# EAGLE schematic MHR15-GLV_PWR (EAGLE 6.6.0)
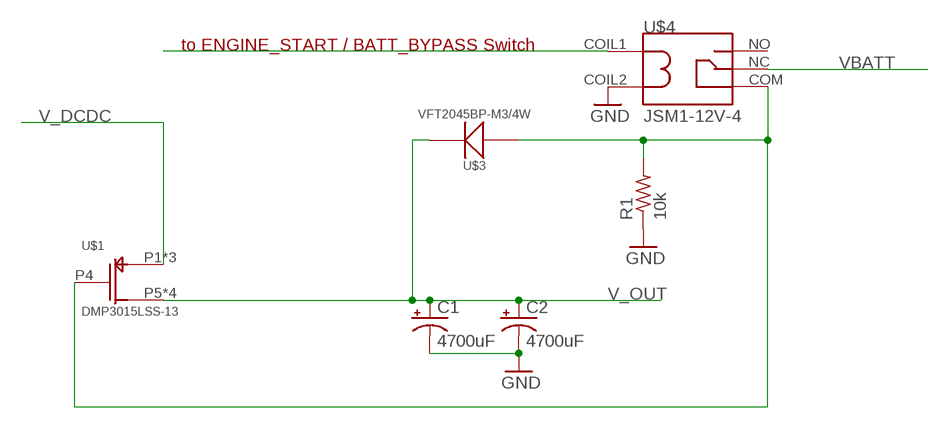
[diagram p0: schematic, sheet 1]

## Parts
C1  4700uF  CAP_POLPTH3  [CPOL-RADIAL-1000UF-63V]
C2  4700uF  CAP_POLPTH3  [CPOL-RADIAL-1000UF-63V]
R1  10k  R-US_R0603  [R0603]
U$1  DMP3015LSS-13  [8-SOP]
U$3  VFT2045BP-M3/4W  [VFT2045BP-M3/4W]
U$4  JSM1-12V-4  [JSM1-12V-4]

## Nets
GND: C1.2(-) C2.2(-) R1.1 U$4.COIL2
N$3: R1.2 U$1.P4(G) U$3.P1 U$4.COM
N$6: U$4.COIL1
V_DCDC: U$1.P1(S) U$1.P2(S) U$1.P3(S)
V_OUT: C1.1(+) C2.1(+) U$1.P5(D) U$1.P6(D) U$1.P7(D) U$1.P8(D) U$3.P2
VBATT: U$4.NC
Unconnected: U$4.NO

## Notes on the sheet
- to ENGINE_START / BATT_BYPASS Switch

## Library data of the parts
C1 C2 = SparkFun-Capacitors:CAP_POL: Capacitor Polarized These are standard SMD and PTH capacitors. Normally 10uF, 47uF, and 100uF in electrolytic and tantalum varieties. Always verify the external diameter of the through hole cap, it varies with capacity, voltage, and manufacturer. The EIA devices should be standard.
R1 = resistor:R-US_: RESISTOR, American symbol
U$1 = MHR15-GLV_PWR:DMP3015LSS-13: MOSFET P-CH 30V 13A 8-SOIC; DIGIKEY_PN: DMP3015LSSDICT-ND; MANUFACTURER: Diodes Incorporated; MFC_PN: DMP3015LSS-13
U$3 = MHR15-GLV_PWR:VFT2045BP-M3/4W: DIODE SCHOTTKY 45V 20A ITO220AC; DIGIKEY_PN: VFT2045BP-M3/4W-ND; MANUFACTURER: Vishay Semiconductor Diodes Division; MFC_PN: VFT2045BP-M3/4W
U$4 = MHR15-GLV_PWR:JSM1-12V-4: RELAY AUTOMOTIVE SPDT 10A 12V; DIGIKEY_PN: 255-1239-ND; MANUFACTURER: Panasonic Electric Works; MFC_PN: JSM1-12V-4